# Altium schematic sheet AS5045.SchDoc
size A
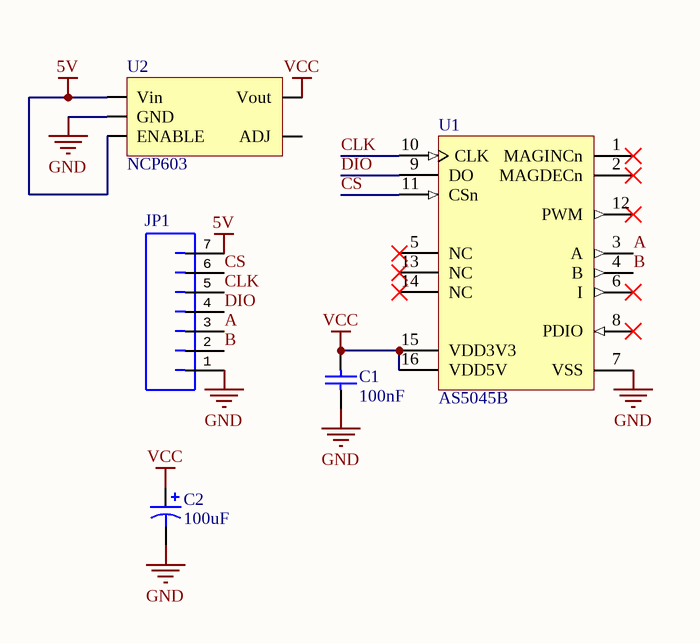
[diagram p0: AS5045.SchDoc]

## Parts
C1  100nF  [CAPC0603(1608)100_M]
C2  100uF  [AVX-CAPC7343_V]
JP1  (no value)  [JST-7-PTH]
U1  AS5045B  [AMS-SSOP-16-6200X5300DE_M]
U2  NCP603  [SOT95P245X110-5N]

## Nets
5V: JP1.7 U2.ENABLE U2.Vin
GND: C1.1 C2.2 JP1.1 U1.7(VSS) U2.GND
VCC: C1.2 C2.1 U1.15(VDD3V3) U1.16(VDD5V) U2.Vout
A: JP1.3 U1.3(A)
B: JP1.2 U1.4(B)
CLK: JP1.5 U1.10(CLK)
CS: JP1.6 U1.11(CSn)
DIO: JP1.4 U1.9(DO)

Not connected (* = marked no-connect by the designer): U1 1(MAGINCn)* 2(MAGDECn)* 5(NC)* 6(I)* 8(PDIO)* 12(PWM)* 13(NC)* 14(NC)*; U2 ADJ

## Library data of the parts
C1 = CMP-1035-02575-1: CAP 100nF 6.3V Â±5% 0603 (1608 Metric) Thickness 1mm SMD; Case-Metric: 1608; Case-EIA: 0603; Tolerance: Â±5%; Technology: SMT; Rated Voltage: 6.3 V; Max Thickness: 1 mm; Value: 100nF
C2 = AVX-CAP-P-2
JP1 = JST_7_RIGHT
U1 = CMP-0870-00004-1: 12-Bit Rotary Position Sensor with Digital Interface, 3.3 or 5 V, -40 to 125 degC, SSOP-16, Pb-Free, Reel; Manufacturer: AMS; PartNumber: AS5045B-ASST; Resolution: 12 bit; Output: SSI, PWM, Incremental A/B/Index; Supply Voltage (V): 3.3 or 5.0; ComponentLink1Description: Manufacturer URL; PackageDescription: 16-Pin Shrink Small Outline Package, 6.2 x 5.3 mm Body, 0.65 mm Pitch; Features: Zero position programming, diagnostic features, daisy chain mode, chip- ID, etc.; ComponentLink1URL: www.ams.com; ComponentLink2URL: http://www.ams.com/eng/content/download/438063/1340357/246195; DatasheetVersion: Rev. 1.0; PackageReference: SSOP-16; PackageVersion: Rev. 1.7, 06/2010; Mounting Technology: Surface Mount; ComponentLink2Description: Datasheet